# Altium schematic sheet Main.SchDoc
size A2
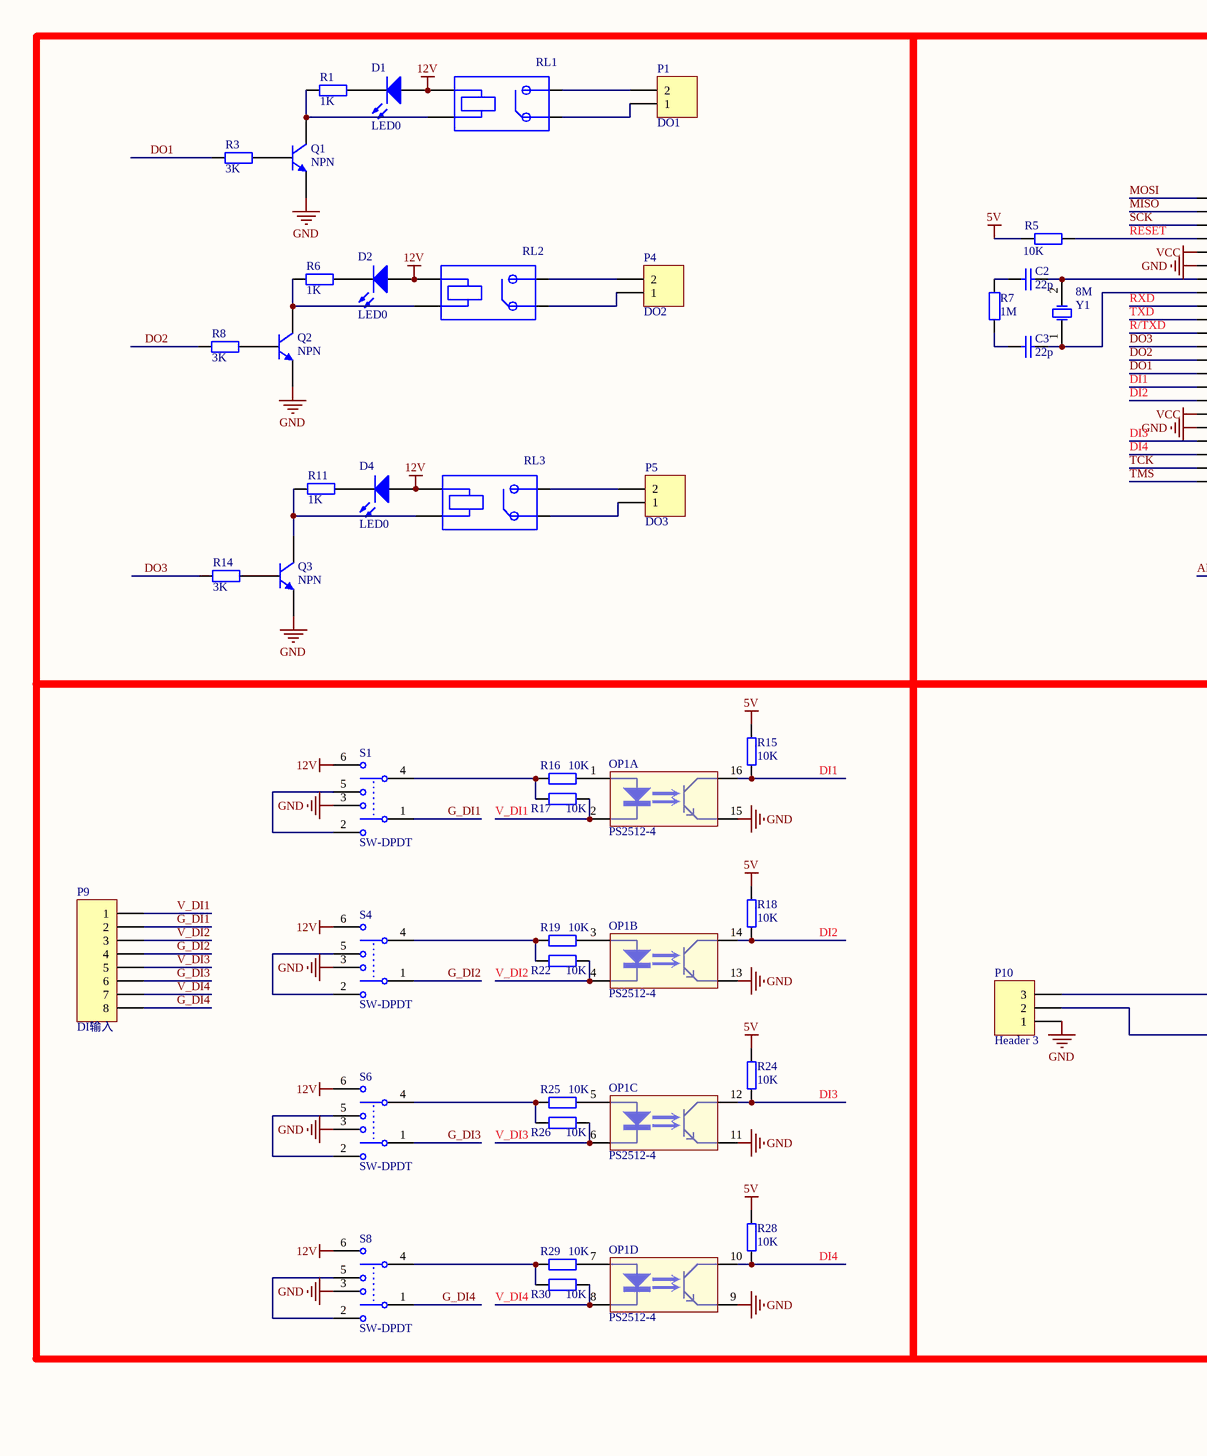
[diagram p0: Main.SchDoc, left]
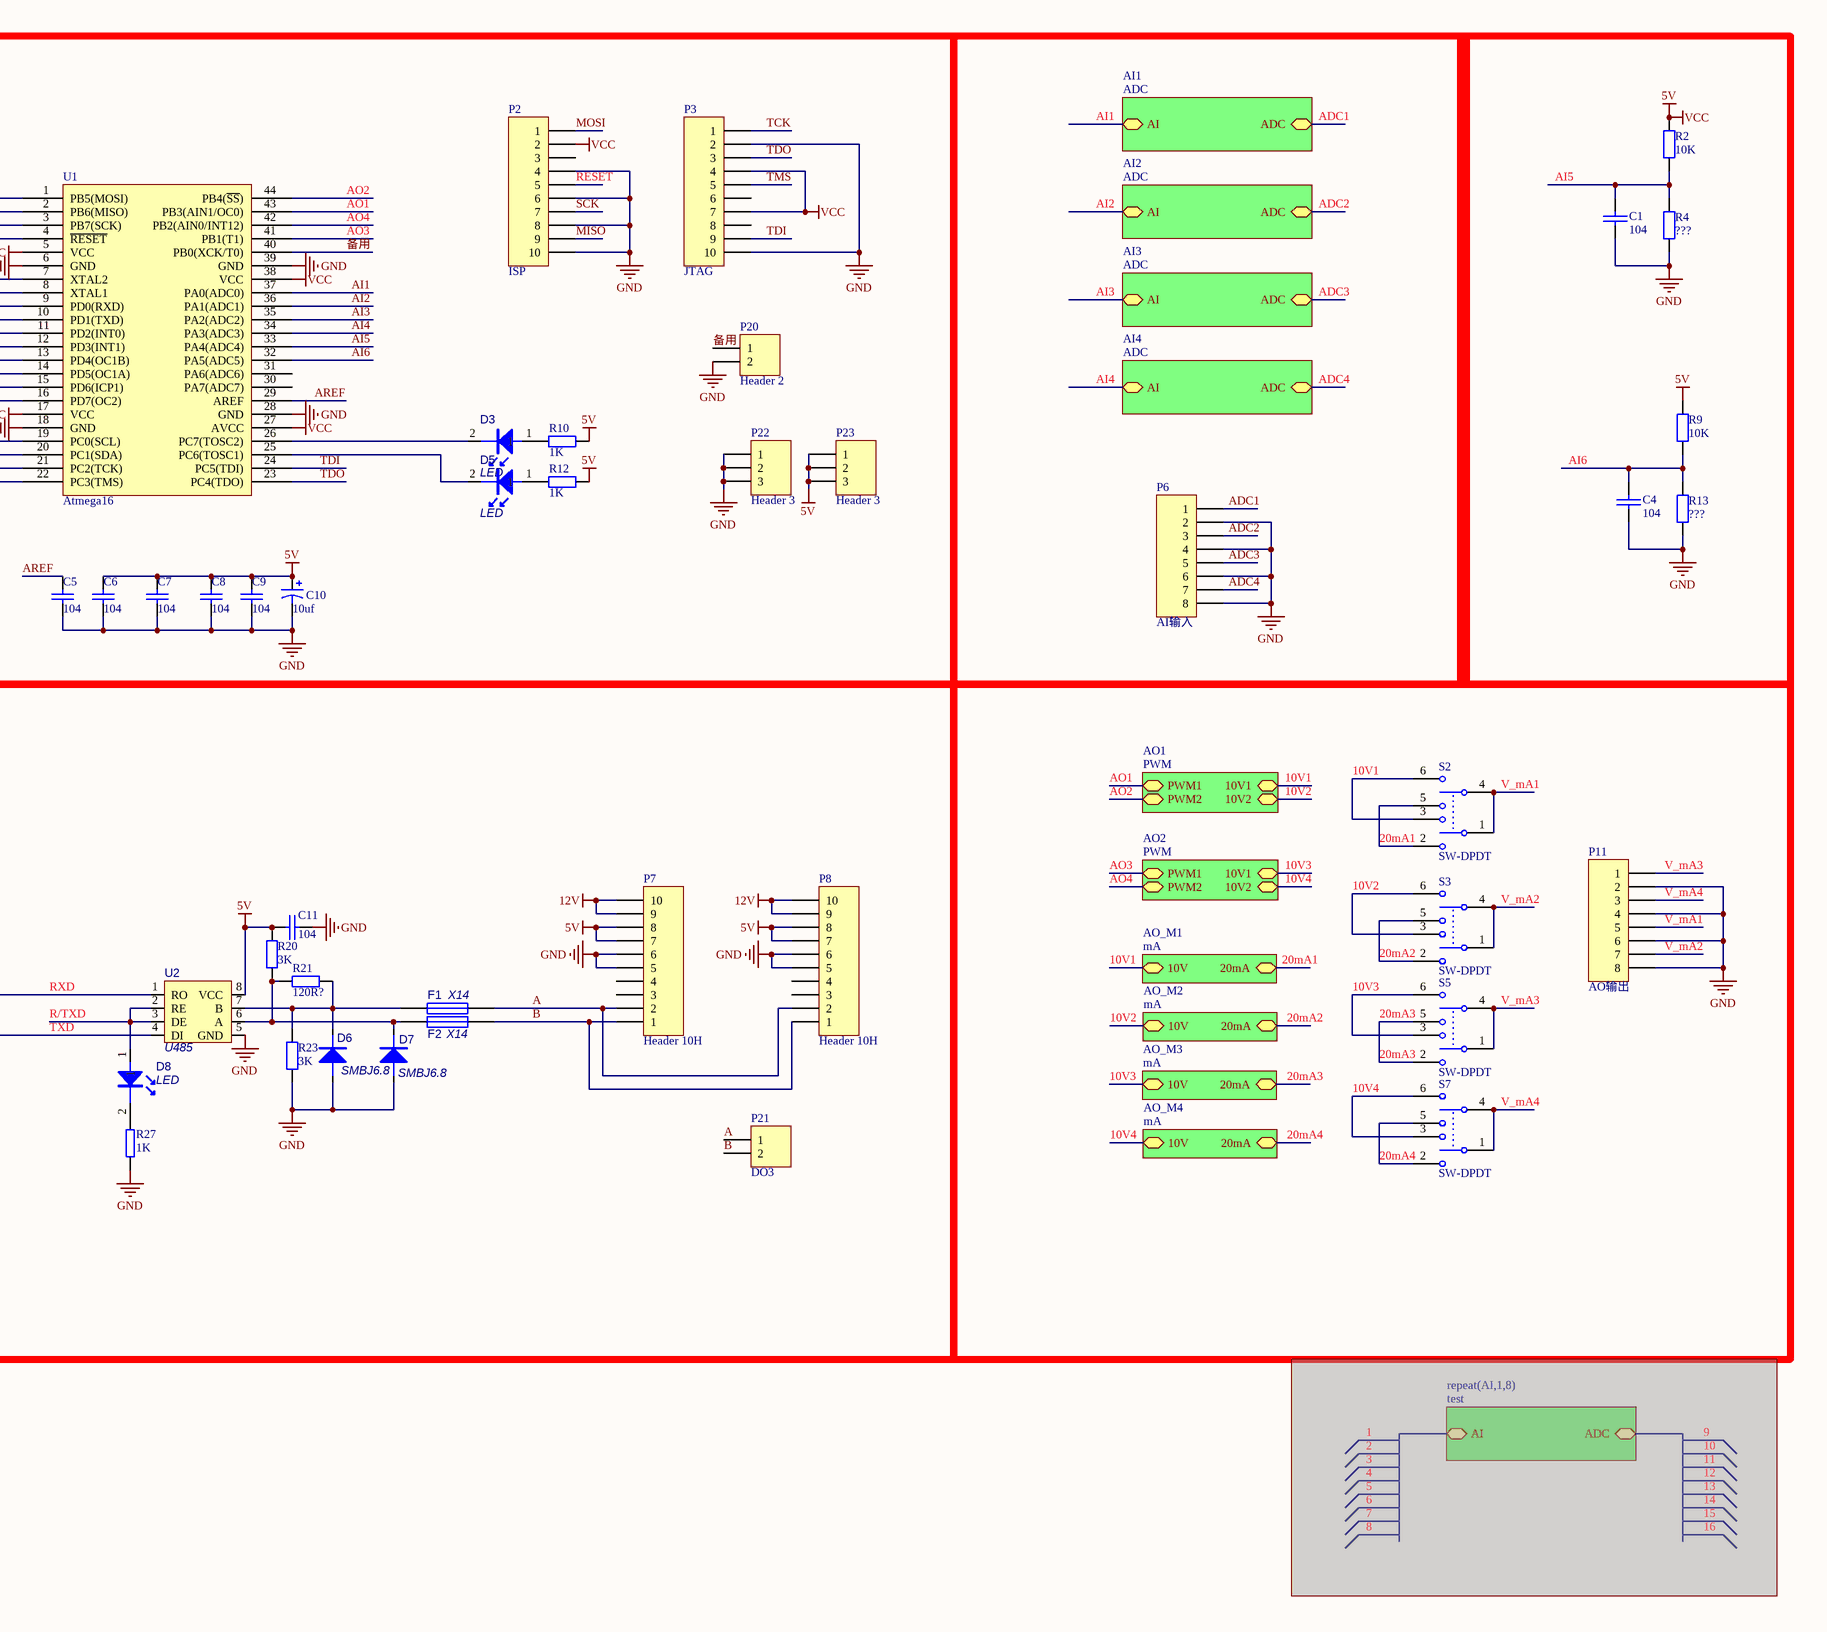
[diagram p1: Main.SchDoc, right]

## Parts
C1  104  [C0805C]
C2  22p  [c0805c]
C3  22p  [c0805c]
C4  104  [C0805C]
C5  104  [c0805c]
C6  104  [c0805c]
C7  104  [c0805c]
C8  104  [c0805c]
C9  104  [c0805c]
C10  10uf  [E6.5MM]
C11  104  [C0805C]
D1  LED0  [LED0805]
D2  LED0  [LED0805]
D3  LED  [LED0805]
D4  LED0  [LED0805]
D5  LED  [LED0805]
D6  SMBJ6.8  [SMBJ_SMT]
D7  SMBJ6.8  [SMBJ_SMT]
D8  LED  [LED0805]
F1  X14  [PPTC_SMT]
F2  X14  [PPTC_SMT]
OP1  PS2512-4  [SO_16]  (parts A,B,C,D of 4)
P1  DO1  [PL2Q]
P2  ISP  [FC10]
P3  JTAG  [FC10P]
P4  DO2  [PL2Q]
P5  DO3  [PL2Q]
P6  AI输入  [8P _COM]
P7  Header 10H  [FC10P_wan]
P8  Header 10H  [FC10P_wan]
P9  DI输入  [8P _COM]
P10  Header 3  [HDR1X3]
P11  AO输出  [8P _COM]
P20  Header 2  [HDR1X2]
P21  DO3  [PL2Q]
P22  Header 3  [HDR1X3]
P23  Header 3  [HDR1X3]
Q1  NPN  [SOT23]
Q2  NPN  [SOT23]
Q3  NPN  [SOT23]
R1  1K  [0805R]
R2  10K  [0805R]
R3  3K  [0805R]
R4  ???  [0805R]
R5  10K  [0805R]
R6  1K  [0805R]
R7  1M  [0805R]
R8  3K  [0805R]
R9  10K  [0805R]
R10  1K  [0805R]
R11  1K  [0805R]
R12  1K  [0805R]
R13  ???  [0805R]
R14  3K  [0805R]
R15  10K  [0805R]
R16  10K  [0805R]
R17  10K  [0805R]
R18  10K  [0805R]
R19  10K  [0805R]
R20  3K  [0805R]
R21  120R?  [0805R]
R22  10K  [0805R]
R23  3K  [0805R]
R24  10K  [0805R]
R25  10K  [0805R]
R26  10K  [0805R]
R27  1K  [0805R]
R28  10K  [0805R]
R29  10K  [0805R]
R30  10K  [0805R]
RL1  (no value)  [HF32A4]
RL2  (no value)  [HF32A4]
RL3  (no value)  [HF32A4]
S1  SW-DPDT  [button]
S2  SW-DPDT  [button]
S3  SW-DPDT  [button]
S4  SW-DPDT  [button]
S5  SW-DPDT  [button]
S6  SW-DPDT  [button]
S7  SW-DPDT  [button]
S8  SW-DPDT  [button]
U1  Atmega16  [QFP44]
U2  U485  [SOP8]
Y1  8M  [XTAL-M]

## Sub-sheets
AI1 = ADC: ADC, AI
AI2 = ADC: ADC, AI
AI3 = ADC: ADC, AI
AI4 = ADC: ADC, AI
AO1 = PWM: PWM1, 10V1, PWM2, 10V2
AO2 = PWM: PWM1, 10V1, PWM2, 10V2
AO_M1 = mA: 10V, 20mA
AO_M2 = mA: 10V, 20mA
AO_M3 = mA: 10V, 20mA
AO_M4 = mA: 10V, 20mA
repeat(AI,1,8) = test (masked out): ADC, AI

## Nets
5V: C6.2 C7.2 C8.2 C9.1 C10.1 C11.1 P2.2 P3.4 P3.7 P7.7 P7.8 P8.7 P8.8 P23.1 P23.2 P23.3 R2.2 R5.2 R9.2 R10.1 R12.1 R15.2 R18.2 R20.2 R24.2 R28.2 U1.5(VCC) U1.17(VCC) U1.27(AVCC) U1.38(VCC) U2.8(VCC)  [also labelled VCC]
12V: D1.1(A) D2.1(A) D4.1(A) P7.9 P7.10 P8.9 P8.10 RL1.1 RL2.1 RL3.1 S1.6 S4.6 S6.6 S8.6
GND: C1.2 C4.2 C5.1 C6.1 C7.1 C8.1 C9.2 C10.2 C11.2 D6.A D7.A OP1.9 OP1.11 OP1.13 OP1.15 P2.4 P2.6 P2.8 P2.10 P3.2 P3.10 P6.2 P6.4 P6.6 P6.8 P7.5 P7.6 P8.5 P8.6 P10.1 P11.2 P11.4 P11.6 P11.8 P20.2 P22.1 P22.2 P22.3 Q1.3(E) Q2.3(E) Q3.3(E) R4.1 R13.1 R23.1 R27.1 S1.3 S4.3 S6.3 S8.3 U1.6(GND) U1.18(GND) U1.28(GND) U1.39(GND) U2.5(GND)
10V1: S2.3 S2.6 ; sheet AO_M1/10V, sheet AO1/10V1
10V2: S3.3 S3.6 ; sheet AO1/10V2, sheet AO_M2/10V
10V3: S5.3 S5.6 ; sheet AO2/10V1, sheet AO_M3/10V
10V4: S7.3 S7.6 ; sheet AO2/10V2, sheet AO_M4/10V
20mA1: S2.2 S2.5 ; sheet AO_M1/20mA
20mA2: S3.2 S3.5 ; sheet AO_M2/20mA
20mA3: S5.2 S5.5 ; sheet AO_M3/20mA
20mA4: S7.2 S7.5 ; sheet AO_M4/20mA
A: F1.1 P7.2 P8.2 P21.1
ADC1: P6.1 ; sheet AI1/ADC
ADC2: P6.3 ; sheet AI2/ADC
ADC3: P6.5 ; sheet AI3/ADC
ADC4: P6.7 ; sheet AI4/ADC
AI1: U1.37(PA0(ADC0)) ; sheet AI1/AI
AI2: U1.36(PA1(ADC1)) ; sheet AI2/AI
AI3: U1.35(PA2(ADC2)) ; sheet AI3/AI
AI4: U1.34(PA3(ADC3)) ; sheet AI4/AI
AI5: C1.1 R2.1 R4.2 U1.33(PA4(ADC4))
AI6: C4.1 R9.1 R13.2 U1.32(PA5(ADC5))
AO1: U1.43(PB3(AIN1/OC0)) ; sheet AO1/PWM1
AO2: U1.44(PB4(~{SS})) ; sheet AO1/PWM2
AO3: U1.41(PB1(T1)) ; sheet AO2/PWM1
AO4: U1.42(PB2(AIN0/INT12)) ; sheet AO2/PWM2
AREF: C5.2 U1.29(AREF)
B: F2.1 P7.1 P8.1 P21.2
DI1: OP1.16 R15.1 U1.15(PD6(ICP1))
DI2: OP1.14 R18.1 U1.16(PD7(OC2))
DI3: OP1.12 R24.1 U1.19(PC0(SCL))
DI4: OP1.10 R28.1 U1.20(PC1(SDA))
DO1: R3.2 U1.14(PD5(OC1A))
DO2: R8.2 U1.13(PD4(OC1B))
DO3: R14.2 U1.12(PD3(INT1))
G_DI1: P9.2 S1.1
G_DI2: P9.4 S4.1
G_DI3: P9.6 S6.1
G_DI4: P9.8 S8.1
MISO: P2.9 U1.2(PB6(MISO))
MOSI: P2.1 U1.1(PB5(MOSI))
R/TXD: D8.1 U1.11(PD2(INT0)) U2.2(RE) U2.3(DE)
RESET: P2.5 R5.1 U1.4(~{RESET})
RXD: P10.3 U1.9(PD0(RXD)) U2.1(RO)
SCK: P2.7 U1.3(PB7(SCK))
TCK: P3.1 U1.21(PC2(TCK))
TDI: P3.9 U1.24(PC5(TDI))
TDO: P3.3 U1.23(PC4(TDO))
TMS: P3.5 U1.22(PC3(TMS))
TXD: P10.2 U1.10(PD1(TXD)) U2.4(DI)
V_DI1: OP1.2 P9.1 R17.2
V_DI2: OP1.4 P9.3 R22.2
V_DI3: OP1.6 P9.5 R26.2
V_DI4: OP1.8 P9.7 R30.2
V_mA1: P11.5 S2.1 S2.4
V_mA2: P11.7 S3.1 S3.4
V_mA3: P11.1 S5.1 S5.4
V_mA4: P11.3 S7.1 S7.4
备用: P20.1 U1.40(PB0(XCK/T0))
NetC2_1: C2.1 U1.7(XTAL2) Y1.2(OSC2)
NetC2_2: C2.2 R7.1
NetC3_1: C3.1 U1.8(XTAL1) Y1.1(OSC1)
NetC3_2: C3.2 R7.2
NetD1_2: D1.2(K) R1.1
NetD2_2: D2.2(K) R6.1
NetD3_1: D3.1 R10.2
NetD3_2: D3.2 U1.26(PC7(TOSC2))
NetD4_2: D4.2(K) R11.1
NetD5_1: D5.1 R12.2
NetD5_2: D5.2 U1.25(PC6(TOSC1))
NetD6_K: D6.K F1.2 R21.2 R23.2 U2.7(B)
NetD7_K: D7.K F2.2 R20.1 R21.1 U2.6(A)
NetD8_2: D8.2 R27.2
NetOP1_1: OP1.1 R16.2
NetOP1_3: OP1.3 R19.2
NetOP1_5: OP1.5 R25.2
NetOP1_7: OP1.7 R29.2
NetP1_1: P1.1 RL1.4
NetP1_2: P1.2 RL1.3
NetP4_1: P4.1 RL2.4
NetP4_2: P4.2 RL2.3
NetP5_1: P5.1 RL3.4
NetP5_2: P5.2 RL3.3
NetQ1_1: Q1.1(C) R1.2 RL1.2
NetQ1_2: Q1.2(B) R3.1
NetQ2_1: Q2.1(C) R6.2 RL2.2
NetQ2_2: Q2.2(B) R8.1
NetQ3_1: Q3.1(C) R11.2 RL3.2
NetQ3_2: Q3.2(B) R14.1
NetR16_1: R16.1 R17.1 S1.4
NetR19_1: R19.1 R22.1 S4.4
NetR25_1: R25.1 R26.1 S6.4
NetR29_1: R29.1 R30.1 S8.4
NetS1_2: S1.2 S1.5
NetS4_2: S4.2 S4.5
NetS6_2: S6.2 S6.5
NetS8_2: S8.2 S8.5

Not connected (* = marked no-connect by the designer): P2 3; P3 6 8; P7 3 4; P8 3 4; U1 30(PA7(ADC7)) 31(PA6(ADC6))

## Library data of the parts
C1 C4 = CAP: Capacitor
C2 C3 C5-C9 = Cap: Capacitor; Published: 8-Jun-2000; LatestRevisionDate: 17-Jul-2002; LatestRevisionNote: Re-released for DXP Platform.; Publisher: Altium Limited
  C2 C3: Value: 22P
  C5-C9: Value: 104
C10 = Cap Pol1: Polarized Capacitor (Radial); Published: 8-Jun-2000; LatestRevisionDate: 17-Jul-2002; LatestRevisionNote: Re-released for DXP Platform.; Publisher: Altium Limited; Value: 10uf
C11 = CAP: Capacitor; 采购信息: 0.1uF 25V X7R,5%,50V,贴片电容 0805
D1 D2 D4 = LED0: Typical INFRARED GaAs LED; Published: 8-Jun-2000; LatestRevisionDate: 08-Jul-2005; LatestRevisionNote: Mech Layer 1 removed.; PackageReference: LED-0; Publisher: Altium Limited; PackageDescription: LED; 2 Leads
D6 D7 = DIODE
F1 F2 = Fuse 1: Fuse; Published: 8-Jun-2000; LatestRevisionDate: 17-Jul-2002; LatestRevisionNote: Re-released for DXP Platform.; PackageReference: PIN-W2/E2.8; Publisher: Altium Limited
P1 P4 P5 P21 = Header 2: Header, 2-Pin; 采购信息: 环保，绿色，两边密闭，180度，两位; LatestRevisionDate: 17-Jul-2002; LatestRevisionNote: Re-released for DXP Platform.; Publisher: Altium Limited
P2 P3 P7 P8 = Header 10H: Header, 10-Pin, Right Angle; LatestRevisionDate: 17-Jul-2002; LatestRevisionNote: Re-released for DXP Platform.; Publisher: Altium Limited
P6 P9 P11 = Header 8: Header, 8-Pin; LatestRevisionDate: 17-Jul-2002; LatestRevisionNote: Re-released for DXP Platform.; Publisher: Altium Limited
P10 P22 P23 = Header 3: Header, 3-Pin; LatestRevisionDate: 17-Jul-2002; LatestRevisionNote: Re-released for DXP Platform.; Publisher: Altium Limited
P20 = Header 2: Header, 2-Pin; LatestRevisionDate: 17-Jul-2002; LatestRevisionNote: Re-released for DXP Platform.; Publisher: Altium Limited
Q1-Q3 = NPN: NPN Bipolar Transistor; Published: 8-Jun-2000; LatestRevisionDate: 17-Jul-2002; LatestRevisionNote: Re-released for DXP Platform.; PackageReference: TO-226-AA; Publisher: Altium Limited; PackageDescription: TO, Flat Index; 3 In-Line, Axial Leads; Body Dia. 4.8mm; Leads 0.55 x 0.51 mm (max); Code_JEDEC: TO-226-AA
R1 R6 R10-R12 = Res2: Resistor; Published: 8-Jun-2000; LatestRevisionDate: 17-Jul-2002; LatestRevisionNote: Re-released for DXP Platform.; PackageReference: AXIAL-0.4; Publisher: Altium Limited; PackageDescription: Axial Device, Thru-Hole; 2 Leads; 0.4 in Pin Spacing; Value: 1K
R2-R5 R7-R9 R13 R14 R16 R17 R19-R23 R25 R26 R29 R30 = Res2: Resistor; Value: 1K; Published: 8-Jun-2000; LatestRevisionDate: 17-Jul-2002; LatestRevisionNote: Re-released for DXP Platform.; PackageReference: AXIAL-0.4; Publisher: Altium Limited; PackageDescription: Axial Device, Thru-Hole; 2 Leads; 0.4 in Pin Spacing
R15 R18 R24 R27 R28 = res
RL1-RL3 = RELAY
S1-S8 = SW-DPDT: Double-Pole, Double-Throw Switch; Published: 24-Mar-1999; LatestRevisionDate: 17-Jul-2002; LatestRevisionNote: Re-released for DXP Platform.; PackageReference: DPDT-6; Publisher: Altium Limited; PackageDescription: Switch; 6 Leads
Y1 = XTAL: Crystal Oscillator; Published: 8-Jun-2000; LatestRevisionDate: 17-Jul-2002; LatestRevisionNote: Re-released for DXP Platform.; Publisher: Altium Limited